# Altium schematic sheet relay.SchDoc
size A3
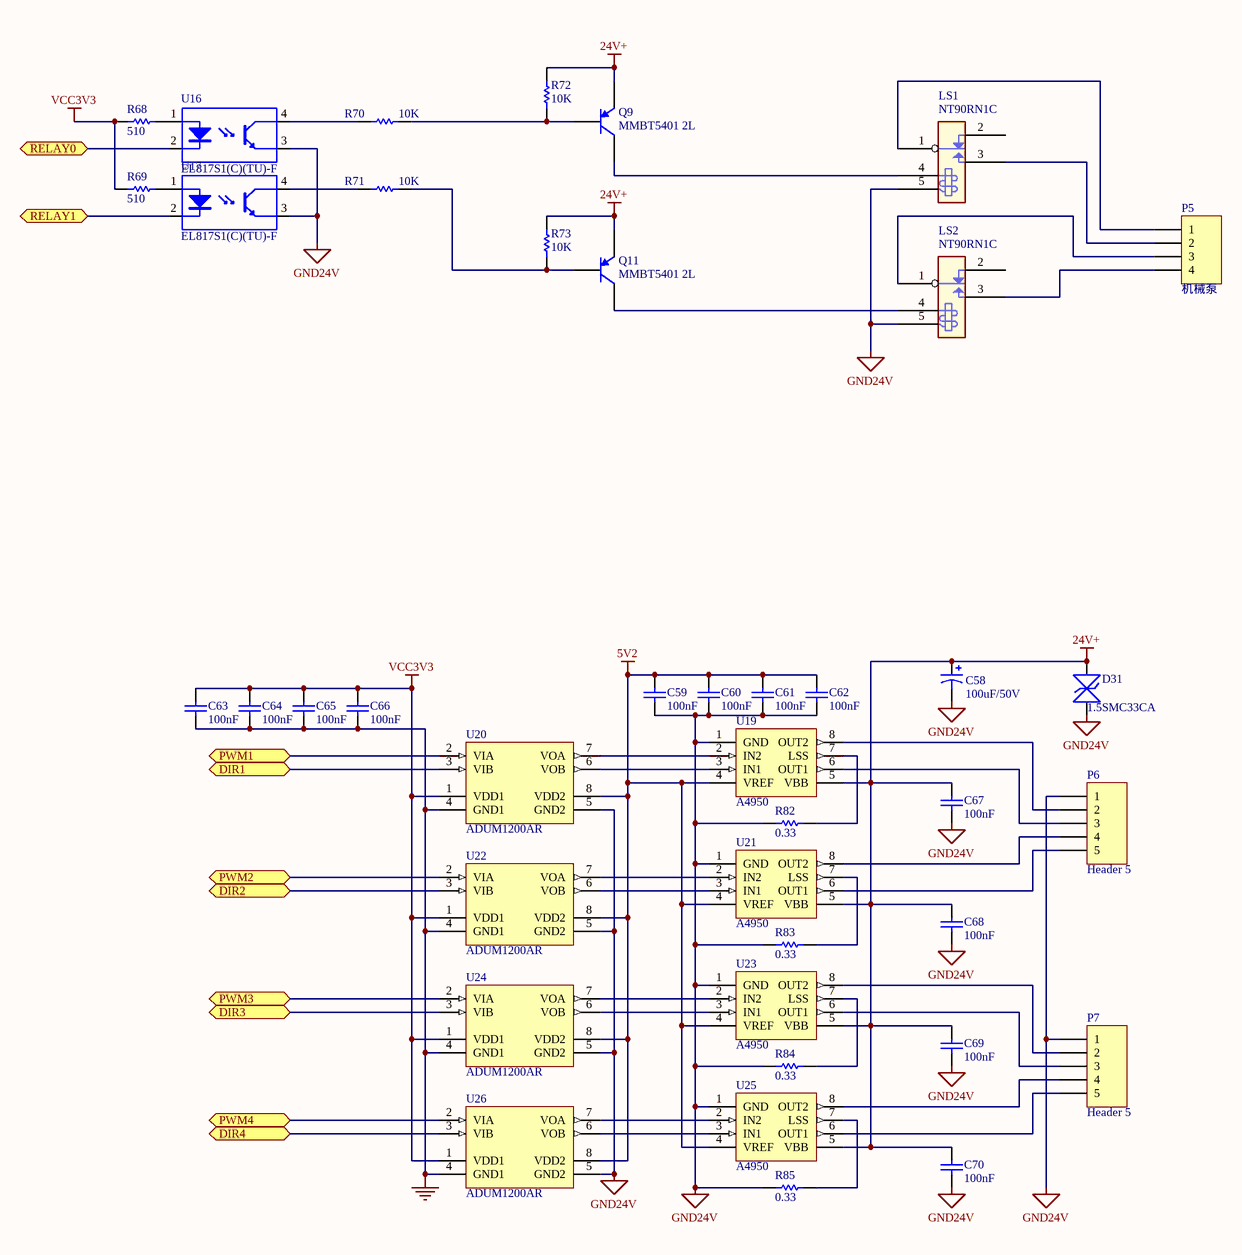
[diagram p0: relay.SchDoc]

## Parts
C58  100uF/50V  [CD1.5/3.2]
C59  100nF  [0805_C]
C60  100nF  [0805_C]
C61  100nF  [0805_C]
C62  100nF  [0805_C]
C63  100nF  [0805_C]
C64  100nF  [0805_C]
C65  100nF  [0805_C]
C66  100nF  [0805_C]
C67  100nF  [0805_C]
C68  100nF  [0805_C]
C69  100nF  [0805_C]
C70  100nF  [0805_C]
D31  1.5SMC33CA  [SMC(DO-214AB)_S1]
LS1  NT90RN1C  [NT90HCE12CE]
LS2  NT90RN1C  [NT90HCE12CE]
P5  机械泵  [MSTBV 2.5/4-G-5.08]
P6  Header 5  [MC1.5/5-ST-3.81]
P7  Header 5  [MC1.5/5-ST-3.81]
Q9  MMBT5401 2L  [SOT-23(SOT-23-3)]
Q11  MMBT5401 2L  [SOT-23(SOT-23-3)]
R68  510  [0805_R]
R69  510  [0805_R]
R70  10K  [0805_R]
R71  10K  [0805_R]
R72  10K  [0805_R]
R73  10K  [0805_R]
R82  0.33  [R2512]
R83  0.33  [R2512]
R84  0.33  [R2512]
R85  0.33  [R2512]
U16  EL817S1(C)(TU)-F  [LC-SMD-4]
U17  EL817S1(C)(TU)-F  [LC-SMD-4]
U19  A4950  [LC-SOIC-8_EP_150mil]
U20  ADUM1200AR  [ADI-R-8_N]
U21  A4950  [LC-SOIC-8_EP_150mil]
U22  ADUM1200AR  [ADI-R-8_N]
U23  A4950  [LC-SOIC-8_EP_150mil]
U24  ADUM1200AR  [ADI-R-8_N]
U25  A4950  [LC-SOIC-8_EP_150mil]
U26  ADUM1200AR  [ADI-R-8_N]

## Ports
DIR1, DIR2, DIR3, DIR4, PWM1, PWM2, PWM3, PWM4, RELAY0, RELAY1

## Nets
5V2: C59.2 C60.2 C61.2 C62.2 U19.4(VREF) U20.8(VDD2) U21.4(VREF) U22.8(VDD2) U23.4(VREF) U24.8(VDD2) U25.4(VREF) U26.8(VDD2)
24V+: C58.1 C67.2 C68.2 C69.2 C70.2 D31.2 Q9.2(E) Q11.2(E) R72.2 R73.2 U19.5(VBB) U21.5(VBB) U23.5(VBB) U25.5(VBB)
GND: C63.1 C64.1 C65.1 C66.1 U20.4(GND1) U22.4(GND1) U24.4(GND1) U26.4(GND1)
GND24V: C58.2 C59.1 C60.1 C61.1 C62.1 C67.1 C68.1 C69.1 C70.1 D31.1 LS1.5(COIL2) LS2.5(COIL2) P6.1 P7.1 R82.2 R83.2 R84.2 R85.2 U16.3(E) U17.3(E) U19.1(GND) U20.5(GND2) U21.1(GND) U22.5(GND2) U23.1(GND) U24.5(GND2) U25.1(GND) U26.5(GND2)
VCC3V3: C63.2 C64.2 C65.2 C66.2 R68.2 R69.2 U20.1(VDD1) U22.1(VDD1) U24.1(VDD1) U26.1(VDD1)
DIR1: U20.3(VIB) ; port DIR1
DIR2: U22.3(VIB) ; port DIR2
DIR3: U24.3(VIB) ; port DIR3
DIR4: U26.3(VIB) ; port DIR4
PWM1: U20.2(VIA) ; port PWM1
PWM2: U22.2(VIA) ; port PWM2
PWM3: U24.2(VIA) ; port PWM3
PWM4: U26.2(VIA) ; port PWM4
RELAY0: U16.2(K) ; port RELAY0
RELAY1: U17.2(K) ; port RELAY1
NetLS1_1: LS1.1(COMMON) P5.1
NetLS1_3: LS1.3(NO) P5.2
NetLS1_4: LS1.4(COIL1) Q9.3(C)
NetLS2_1: LS2.1(COMMON) P5.3
NetLS2_3: LS2.3(NO) P5.4
NetLS2_4: LS2.4(COIL1) Q11.3(C)
NetP6_2: P6.2 U19.8(OUT2)
NetP6_3: P6.3 U19.6(OUT1)
NetP6_4: P6.4 U21.8(OUT2)
NetP6_5: P6.5 U21.6(OUT1)
NetP7_2: P7.2 U23.8(OUT2)
NetP7_3: P7.3 U23.6(OUT1)
NetP7_4: P7.4 U25.8(OUT2)
NetP7_5: P7.5 U25.6(OUT1)
NetQ9_1: Q9.1(B) R70.2 R72.1
NetQ11_1: Q11.1(B) R71.2 R73.1
NetR68_1: R68.1 U16.1(A)
NetR69_1: R69.1 U17.1(A)
NetR70_1: R70.1 U16.4(C)
NetR71_1: R71.1 U17.4(C)
NetR82_1: R82.1 U19.7(LSS)
NetR83_1: R83.1 U21.7(LSS)
NetR84_1: R84.1 U23.7(LSS)
NetR85_1: R85.1 U25.7(LSS)
NetU19_2: U19.2(IN2) U20.7(VOA)
NetU19_3: U19.3(IN1) U20.6(VOB)
NetU21_2: U21.2(IN2) U22.7(VOA)
NetU21_3: U21.3(IN1) U22.6(VOB)
NetU23_2: U23.2(IN2) U24.7(VOA)
NetU23_3: U23.3(IN1) U24.6(VOB)
NetU25_2: U25.2(IN2) U26.7(VOA)
NetU25_3: U25.3(IN1) U26.6(VOB)

Not connected (* = marked no-connect by the designer): LS1 2(NC); LS2 2(NC)

## Library data of the parts
C58 = Cap Pol1: Polarized Capacitor (Radial); Value: 100pF; Published: 8-Jun-2000; LatestRevisionDate: 17-Jul-2002; LatestRevisionNote: Re-released for DXP Platform.; PackageReference: RB7.6-15; Publisher: Altium Limited
C59-C70 = 0805 100nF(104) 10% 50V: 贴片电容; ComponentLink1Description: 供应商链接; ComponentLink1URL: http://www.szlcsc.com/product/details_50686.html; Package: 0805; Supplier: LC; SuppliersPartNumber: C49678
D31 = TVS
P5 = Header 4H: Header, 4-Pin, Right Angle; LatestRevisionDate: 17-Jul-2002; LatestRevisionNote: Re-released for DXP Platform.; Publisher: Altium Limited
P6 P7 = Header 5: Header, 5-Pin; LatestRevisionDate: 17-Jul-2002; LatestRevisionNote: Re-released for DXP Platform.; Publisher: Altium Limited
Q9 Q11 = SOT-23 MMBT5401 2L: 三极管; ComponentLink1Description: 供应商链接; ComponentLink1URL: http://www.szlcsc.com/product/details_8818.html; Package: SOT-23; Supplier: LC; SuppliersPartNumber: C8326
R68-R73 R82-R85 = Res1: Resistor; Value: 1K; Published: 8-Jun-2000; LatestRevisionDate: 17-Jul-2002; LatestRevisionNote: Re-released for DXP Platform.; PackageReference: AXIAL-0.3; Publisher: Altium Limited
U16 U17 = TLP521: Text Field1: 80; Text Field2: 50
U20 U22 U24 U26 = ADUM1200AR: Dual Channel Digital Isolator, 2.5 KV rms Insulation Rating, 1 Mbps Data Rate, 150 ns Delay, Industrial, 8-pin SOIC (R-8), Tube; Manufacturer: Analog Devices; Insulation Rating (kVrms): 2.5; Max Data Rate: 1Mbps; DatasheetVersion: Rev. I; PackageVersion: 060506-A, 06/2006; PackageReference: R-8; PackageDescription: 8-Pin Standard Small Outline Package, Body 4.9 x 3.9 mm, Pitch 1.27 mm; Supplier 1: Digi-Key; Supplier Part Number 1: ADUM1200AR-ND; Supplier 2: Mouser; Supplier Part Number 2: 584-ADUM1200AR; Max Operating Temp (degreesC): 125; Mounting Technology: Surface Mount; Code_JEDEC: MS-012-AA; PartNumber: ADUM1200AR; ComponentLink1Description: Manufacturer URL; ComponentLink1URL: http://www.analog.com/en/index.html; ComponentLink2Description: Datasheet; ComponentLink2URL: http://www.analog.com/static/imported-files/data_sheets/ADuM1200_1201.pdf; ComponentLink3Description: Package Specification; ComponentLink3URL: http://www.analog.com/static/imported-files/packages/PKG_PDF/SOIC_Narrow%20(R)/R_8.pdf; ComponentLink4Description: URL Link1; ComponentLink4URL: Product URL:http://www.analog.com/en/interface-isolation/digital-isolators/adum1200/products/product.html